# EAGLE design NANO-walkie-talkie-JLC1 (EAGLE 9.5.2)
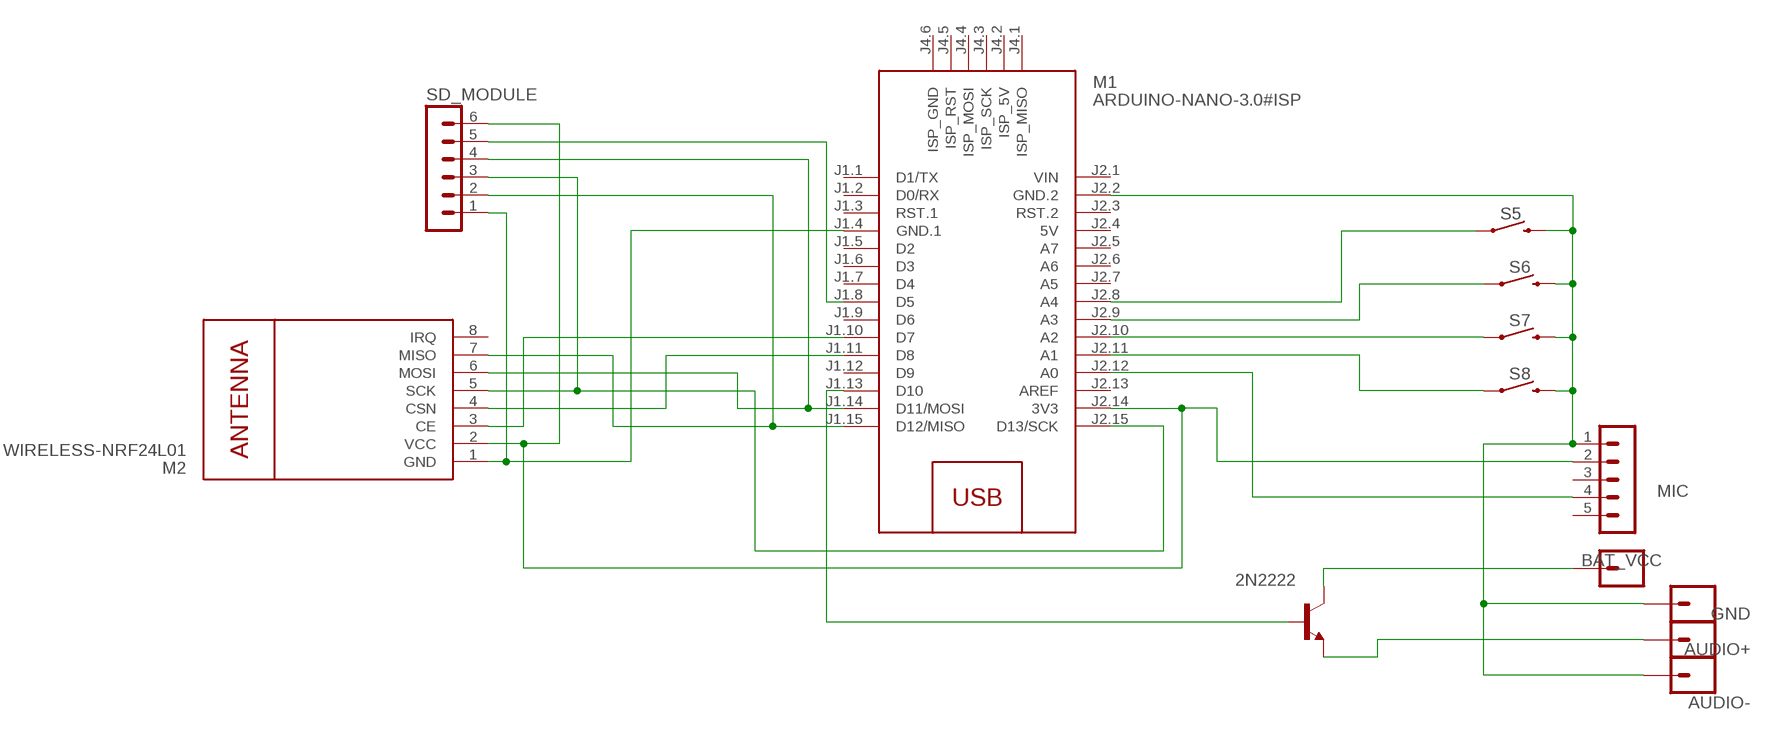
[diagram p0: schematic, sheet 1]

## Parts
AUDIO+  CONN_01PTH_LONGPAD  [1X01_LONGPAD]
AUDIO-  CONN_01PTH_LONGPAD  [1X01_LONGPAD]
BAT_VCC  CONN_01PTH_LONGPAD  [1X01_LONGPAD]
GND  CONN_01PTH_LONGPAD  [1X01_LONGPAD]
M1  ARDUINO-NANO-3.0#ISP  [ARDUINO-NANO-3.0#ISP]
M2  WIRELESS-NRF24L01  [WIRELESS-NRF24L01]
MIC  MA05-1  [MA05-1]
S5  MOMENTARY-SWITCH-SPST-SMD-6.0X3.5MM  [TACTILE_SWITCH_SMD_6.0X3.5MM]
S6  MOMENTARY-SWITCH-SPST-SMD-6.0X3.5MM  [TACTILE_SWITCH_SMD_6.0X3.5MM]
S7  MOMENTARY-SWITCH-SPST-SMD-6.0X3.5MM  [TACTILE_SWITCH_SMD_6.0X3.5MM]
S8  MOMENTARY-SWITCH-SPST-SMD-6.0X3.5MM  [TACTILE_SWITCH_SMD_6.0X3.5MM]
SD_MODULE  MA06-1  [MA06-1]
T1  2N2222  [TO18]

## Nets
6: M1.J2.14(3V3) M2.2(VCC) MIC.2 SD_MODULE.6
BAT_VCC: BAT_VCC.1 T1.3(C)
GND: AUDIO-.1 GND.1 M1.J2.2(GND.2) MIC.1 S5.2 S6.2 S7.2 S8.2
N$1: M1.J1.8(D5) SD_MODULE.5
N$2: M1.J1.4(GND.1) M2.1(GND) SD_MODULE.1
N$3: M1.J1.10(D7) M2.3(CE)
N$4: M1.J1.11(D8) M2.4(CSN)
N$5: M1.J2.15(D13/SCK) M2.5(SCK) SD_MODULE.3
N$6: M1.J1.14(D11/MOSI) M2.6(MOSI) SD_MODULE.4
N$7: M1.J1.15(D12/MISO) M2.7(MISO) SD_MODULE.2
N$8: M1.J2.11(A1) S8.1
N$9: M1.J2.10(A2) S7.1
N$10: M1.J2.9(A3) S6.1
N$11: M1.J2.8(A4) S5.1
N$13: M1.J1.13(D10) T1.2(B)
N$14: M1.J2.12(A0) MIC.4
SPEAKER+: AUDIO+.1 T1.1(E)
Unconnected: M1.J1.1(D1/TX) M1.J1.2(D0/RX) M1.J1.3(RST.1) M1.J1.5(D2) M1.J1.6(D3) M1.J1.7(D4) M1.J1.9(D6) M1.J1.12(D9) M1.J2.3(RST.2) M1.J2.5(A7) M1.J2.6(A6) M1.J2.7(A5) M1.J2.13(AREF) M1.J4.1(ISP_MISO) M1.J4.2(ISP_5V) M1.J4.3(ISP_SCK) M1.J4.4(ISP_MOSI) M1.J4.5(ISP_RST) M1.J4.6(ISP_GND) M2.8(IRQ) MIC.3 MIC.5

## Power pins joined to a net without a drawn wire
5V: M1.J2.4(5V)
VIN: M1.J2.1(VIN)

## Library data of the parts
AUDIO+ AUDIO- BAT_VCC GND = SparkFun-Connectors:CONN_01: Single connection point. Often used as Generic Header-pin footprint for 0.1 inch spaced/style header connections On any of the 0.1 inch spaced packages, you can populate with these: Break Away Headers - Straight <https://www.sparkfun.com/products/116> (PRT-00116) Break Away Male Headers - Right Angle <https://www.sparkfun.com/products/553> (PRT-00553) Female Headers <https://www.sparkfun.com/products/115> (PRT-00115) Break Away Headers - Machine Pin <https://www.sparkfun.com/products/117> (PRT-00117) Break Away Female Headers - Swiss Machine Pin <https://www.sparkfun.com/products/743> (PRT-00743) This device is also useful as a general connection point to wire up your design to another part of your project. Our various solder wires solder well into these plated through hole pads. Hook-Up Wire - Assortment (Stranded, 22 AWG) <https://www.sparkfun.com/products/11375> (PRT-11375) Hook-Up Wire - Assortment (Solid Core, 22 AWG) <https://www.sparkfun.com/products/11367> (PRT-11367) View the entire wire category on our website here <https://www.sparkfun.com/categories/141> Special notes: SMTSO-256-ET is a "flush mount" nut for a 4-40 screw. We mostly use this on specialty testbeds; it is a nice way to connect hardware to your PCB at an adjustable hieght. Also note, the SNAP packages are for using a snappable style connector. We sell a baggie of snaps and they are also used on two LilyPad designs: Snap Assortment - 30 pack (male and female) <https://www.sparkfun.com/products/11347> (DEV-11347) LilyPad Arduino SimpleSnap <https://www.sparkfun.com/products/10941> (DEV-10941) LilyPad SimpleSnap Protoboard <https://www.sparkfun.com/products/10940> (DEV-10940)
M1 = diy-modules:ARDUINO-NANO-3.0#ISP: Arduino Nano 3.0 (and compatible devices) with ISP pads More details available here: https://www.arduino.cc/en/Main/ArduinoBoardNano Click here to find device on ebay.com <http://www.ebay.com/sch/arduino+nano>
M2 = diy-modules:WIRELESS-NRF24L01: 2.4 GHz Wireless Module based on NRF24L01 chip More details available here: http://www.electrodragon.com/w/NRF24L01 Click here to find device on ebay.com <http://www.ebay.com/sch/nrf24l01+arduino>
MIC = con-lstb:MA05-1: PIN HEADER; OC_FARNELL: unknown; OC_NEWARK: unknown
S5-S8 = SparkFun-Switches:MOMENTARY-SWITCH-SPST: Momentary Switch (Pushbutton) - SPST Normally-open (NO) SPST momentary switches (buttons, pushbuttons). Variants PTH-12MM - 12mm square, through-hole Momentary Pushbutton Switch - 12mm Square <https://www.sparkfun.com/products/9190> (COM-09190) PTH-6.0MM, PTH-6.0MM-KIT - 6.0mm square, through-hole Mini Pushbutton Switch <https://www.sparkfun.com/products/97> (COM-00097) KIT package intended for soldering kit's - only one side of pads' copper is exposed. PTH-RIGHT-ANGLE-KIT - Right-angle, through-hole Right Angle Tactile Button <https://www.sparkfun.com/products/10791> - Used on SparkFun BigTime Watch Kit <https://www.sparkfun.com/products/11734> SMD-12MM - 12mm square, surface-mount Tactile Button - SMD (12mm) <https://www.sparkfun.com/products/12993> (COM-12993) Used on SparkFun PicoBoard <https://www.sparkfun.com/products/11888> SMD-4.5MM - 4.5mm Square Trackball Switch Used on SparkFun Blackberry Trackballer Breakout <https://www.sparkfun.com/products/13169> SMD-4.6MMX2.8MM - 4.60mm x 2.80mm, surface mount Used on SparkFun SAMD21 Mini Breakout <https://www.sparkfun.com/products/13664> SMD-5.2MM, SMD-5.2-REDUNDANT - 5.2mm square, surface-mount Mini Pushbutton Switch - SMD <https://www.sparkfun.com/products/8720> (COM-08720) Used on Arduino Pro Mini <https://www.sparkfun.com/products/11114> REDUNDANT package connects both switch circuits together SMD-6.0X3.5MM - 6.0 x 3.5mm, surface mount Momentary Reset Switch SMD <https://www.sparkfun.com/products/8229> (COM-08229) SMD-6.2MM-TALL - 6.2mm square, surface mount Tactile Button - SMD (6mm) <https://www.sparkfun.com/products/12992> Used on SparkFun Digital Sandbox <https://www.sparkfun.com/products/12651> SMD-RIGHT-ANGLE - Right-angle, surface mount Used on SparkFun Block for Intel® Edison - Arduino <https://www.sparkfun.com/products/13036>; PROD_ID: SWCH-14278; SF_SKU: COM-08229
SD_MODULE = con-lstb:MA06-1: PIN HEADER; OC_FARNELL: unknown; OC_NEWARK: unknown
T1 = transistor:2N2222: NPN TRANSISTOR

## Board
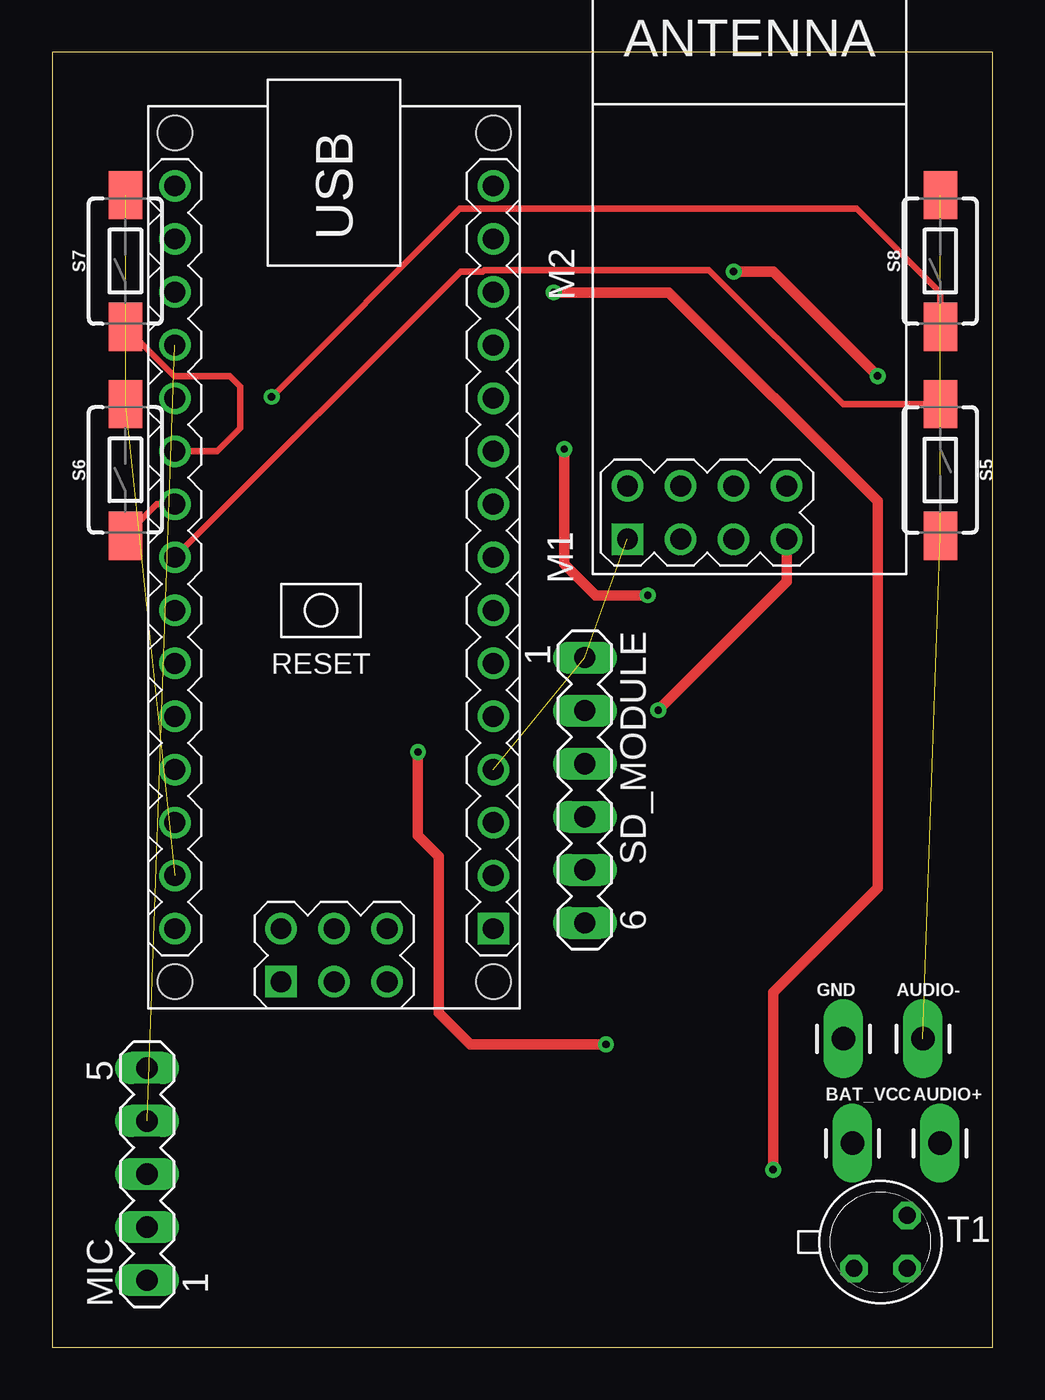
[diagram p1: board, top side]
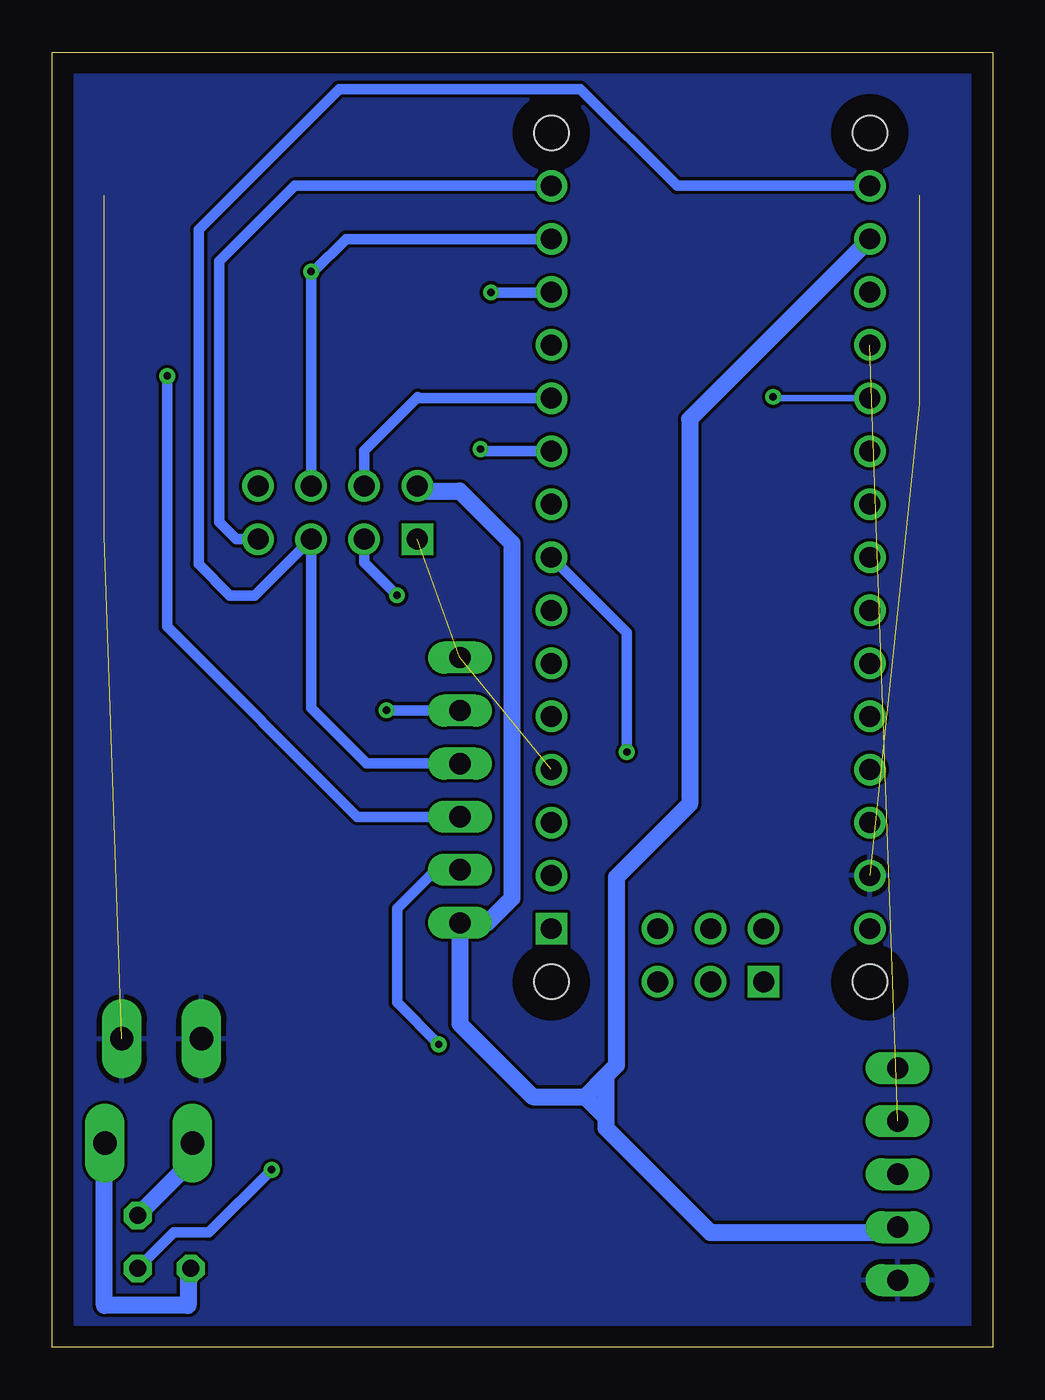
[diagram p2: board, bottom side, seen from below]

Size 45 x 62 mm. Coordinates in mm from the lower left corner, seen from the top.
Outline: 0,0 45,0 45,62 0,62 0,0
Copper layers (1*16): Top 0.035mm / dielectric 1.5mm / Bottom 0.035mm
Design rules "default": minimum track width 6mil, minimum drill 0.35mm, track to track 6mil, track to pad 6mil, pad to pad 6mil, via to via 6mil, smd to smd 6mil, copper to edge 40mil, drill to drill 6mil, minimum pad ring 10mil, minimum via ring 8mil, stop-mask expansion 4mil, vias tented up to drill 0mil, thermal gap 10mil

### Footprints (pad centres in the part's own frame; a part is rotated, then mirrored left to right if it is on the bottom)
1X01_LONGPAD = drill 1.118 pad 1.88 long: 1 0,0
ARDUINO-NANO-3.0#ISP = drill 1 square: J1.1 17.78,7.62; J4.1 20.32,-2.54 | drill 1: J1.2 15.24,7.62; J1.3 12.7,7.62; J1.4 10.16,7.62; J1.5 7.62,7.62; J1.6 5.08,7.62; J1.7 2.54,7.62; J1.8 0,7.62; J1.9 -2.54,7.62; J1.10 -5.08,7.62; J1.11 -7.62,7.62; J1.12 -10.16,7.62; J1.13 -12.7,7.62; J1.14 -15.24,7.62; J1.15 -17.78,7.62; J2.1 17.78,-7.62; J2.2 15.24,-7.62; J2.3 12.7,-7.62; J2.4 10.16,-7.62; J2.5 7.62,-7.62; J2.6 5.08,-7.62; J2.7 2.54,-7.62; J2.8 0,-7.62; J2.9 -2.54,-7.62; J2.10 -5.08,-7.62; J2.11 -7.62,-7.62; J2.12 -10.16,-7.62; J2.13 -12.7,-7.62; J2.14 -15.24,-7.62; J2.15 -17.78,-7.62; J4.2 17.78,-2.54; J4.3 20.32,0; J4.4 17.78,0; J4.5 20.32,2.54; J4.6 17.78,2.54 | hole 1.651: -20.32,7.62; -20.32,-7.62; 20.32,-7.62; 20.32,7.62
WIRELESS-NRF24L01 = drill 1 square: 1 -12.7,6.35 | drill 1: 2 -10.16,6.35; 3 -12.7,3.81; 4 -10.16,3.81; 5 -12.7,1.27; 6 -10.16,1.27; 7 -12.7,-1.27; 8 -10.16,-1.27
MA05-1 = drill 1.016 long: 1 -5.08,0; 2 -2.54,0; 3 0,0; 4 2.54,0; 5 5.08,0
TACTILE_SWITCH_SMD_6.0X3.5MM = smd 2.3 x 1.6: 1 -3.15,0; 2 3.15,0
MA06-1 = drill 1.016 long: 1 -6.35,0; 2 -3.81,0; 3 -1.27,0; 4 1.27,0; 5 3.81,0; 6 6.35,0
TO18 = drill 0.813 octagon: 1 -1.27,-1.27; 2 1.27,-1.27; 3 1.27,1.27

### Placement (x,y rotation side)
AUDIO+  42.48,9.77 0 top
AUDIO-  41.67,14.77 0 top
BAT_VCC  38.29,9.77 0 top
GND  37.86,14.77 0 top
M1  13.49,37.82 270 top
M2  33.88,51.39 90 top
MIC  4.54,8.29 90 top
S5  42.5,42 270 top
S6  3.5,42 90 top
S7  3.5,52 90 top
S8  42.5,52 90 top
SD_MODULE  25.49,26.67 270 top
T1  39.64,5.04 0 top

### Tracks (layer width: path | path; a pad name or v marks a point on that pad's centre or on a via)
6
  Bottom 0.813: M2.2 27.3,41 25.5,41 23,38.5 23,21.5 24.18,20.32 SD_MODULE.6 25.49,15.49 22,12 19.5,12 | 18.5,13 18.5,11 | 18.5,11 18.5,10.5 13.5,5.5 4,5.5 4.25,5.75 MIC.2 | 18.5,13 18,13.5 18,22.5 14.5,26 14.5,44.43 M1.J2.14 | 18.5,13 19.5,12 | 19.5,12 18.5,11
BAT_VCC
  Bottom 0.813: T1.3 38.29,8.93 BAT_VCC.1
GND  (4 unrouted)
  pour Bottom: 0.5,61.5 44.5,61.5 44.5,0.5 0.5,0.5
N$1  (via drill 0.35)
  Top 0.508: v17.5,28.5 17.5,24.5 18.5,23.5 18.5,16 20,14.5 v26.5,14.5
  Bottom 0.508: M1.J1.8 17.5,34.21 v17.5,28.5 | v26.5,14.5 28.5,16.5 28.5,21 26.5,23 25.63,23 SD_MODULE.5
N$2  (2 unrouted)
N$3  (via drill 0.35)
  Top 0.508: v24.5,43 24.5,37.5 26,36 v28.5,36
  Bottom 0.508: M1.J1.10 24.4,42.9 v24.5,43 | v28.5,36 30.07,37.57 M2.3
N$4
  Bottom 0.508: M1.J1.11 27.44,45.44 27.5,45.5 30.07,42.93 M2.4
N$5
  Bottom 0.508: M1.J2.15 15.1,55.6 19.74,60.24 31.26,60.24 38,53.5 38,37.5 36.5,36 35.3,36 M2.5 32.61,30.61 29.94,27.94 SD_MODULE.3
N$6  (via drill 0.35)
  Top 0.508: v39.5,46.5 34.5,51.5 v32.61,51.5
  Bottom 0.508: M1.J1.14 30.94,53.06 32.5,51.5 v32.61,51.5 M2.6 | SD_MODULE.4 30.4,25.4 39.5,34.5 v39.5,46.5
N$7  (via drill 0.35)
  Top 0.508: v29,30.5 35.15,36.65 M2.7
  Bottom 0.508: M1.J1.15 33.4,55.6 37,52 37,39.5 36.19,38.69 M2.7 | SD_MODULE.2 28.98,30.48 v29,30.5
N$8  (via drill 0.35)
  Top 0.3: S8.1 42.5,50.5 38.5,54.5 19.5,54.5 v10.5,45.5
  Bottom 0.3: M1.J2.11 10.44,45.44 v10.5,45.5
N$9
  Top 0.3: S7.1 5.85,46.5 8.5,46.5 9,46 9,44 7.9,42.9 M1.J2.10
N$10
  Top 0.3: S6.1 5.01,40.36 M1.J2.9
N$11
  Top 0.3: S5.1 37.85,45.15 31.42,51.58 20.67,51.58 20.6,51.5 19.55,51.5 M1.J2.8
N$13  (via drill 0.35)
  Top 0.508: v24,50.5 29.5,50.5 39.5,40.5 39.5,22 34.5,17 v34.5,8.5
  Bottom 0.508: M1.J1.13 21.13,50.5 v24,50.5 | v34.5,8.5 37.5,5.5 39.18,5.5 T1.2
N$14  (1 unrouted)
SPEAKER+
  Bottom 0.813: T1.1 38.5,3.64 38.5,2 42.5,2 42.5,9.75 AUDIO+.1